# Altium schematic sheet Main.SchDoc: Main
size A4; Date: 05.10.2017; CheckedBy: UNCHECKED; Author: Lukas Deeken; Organization: Baltic Racing; Address1: Zur Schwedenschanze 15; Address2: Haus 18; Address3: 18435 Stralsund; Revision: 0.9; SheetNumber: 01; SheetTotal: 01; Rules: TODO; ProjectName: Projekt
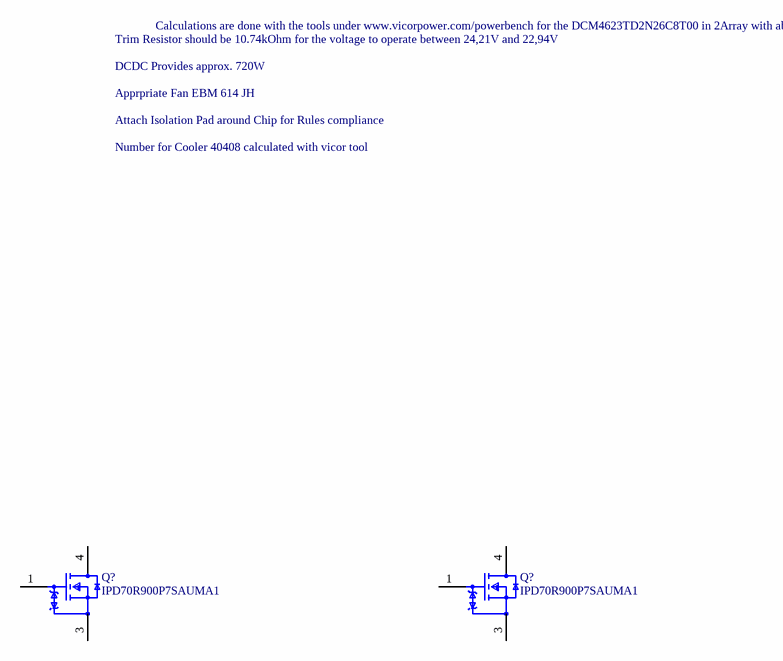
[diagram p0: Main.SchDoc]

## Parts
(Parts that share a designator on the sheet are numbered #1, #2 ... from top to bottom, then left to right.)
Q?#1  IPD70R900P7SAUMA1  [FP-PG-TO252-3-MFG]
Q?#2  IPD70R900P7SAUMA1  [FP-PG-TO252-3-MFG]

## Nets

Not connected (* = marked no-connect by the designer): Q?#1 1(Gate) 3(Source) 4(Drain); Q?#2 1(Gate) 3(Source) 4(Drain)

## Notes on the sheet
- Trim Resistor should be 10.74kOhm for the voltage to operate between 24,21V and 22,94V
- Calculations are done with the tools under www.vicorpower.com/powerbench for the DCM4623TD2N26C8T00 in 2Array with about 30A output at 24V out and between 131V to 280V
- DCDC Provides approx. 720W
- Apprpriate Fan EBM 614 JH
- Attach Isolation Pad around Chip for Rules compliance
- Number for Cooler 40408 calculated with vicor tool
- Title:
- Projekt:
- Revision:
- Author:
- Rules:
- Checked by:
- Sheet
- of
- Size:
- A4
- Date:
- Time:

## Library data of the parts
Q?#1 Q?#2 = CMP-32901-000138-1: MOSFET N-CH 700V 6A TO252-3; Manufacturer: Infineon; Gate To Source Voltage: 16V; Turn Off Delay Time: 58ns; Standoff Height: 0mm; Number Of Channels: 1; Input Capacitace At Vds: 211pF @ 400V; Depletion Mode: False; Threshold Vgs Min: 2.5V; Max Junction Temp: +150°C; Turn On Delay Time: 12ns; Threshold Vgs Max: 3.5V; Pulse Drain Current: 12.8A; Rthja Max: 62°C/W; Power Dissipation: 30.5W; Typ Forward Diode Voltage: 0.9V; Gate Charge At Vgs: 6.8nC @ 10V; Reverse Recovery Charge: 500nC; Reverse Recovery Time: 160ns; Drain To Source Resistance: 0.74Ω; Octopart: https://octopart.com/ipd70r900p7sauma1-infineon-77042867; Height: 2.55mm; ComponentLink2URL: https://www.infineon.com/dgdl/Infineon-IPD70R900P7S-DataSheet-v02_02-EN.pdf?fileId=5546d462584d1d4a0158cf8102e90d98; Temperature Range High: +150°C; Temperature: -40°C to +150°C; Footprint Url: https://www.infineon.com/cms/en/product/packages/PG-TO252/PG-TO252-3-344/; ComponentLink2Description: Datasheet; Drain To Source Voltage: 700V; Manufacturer Part Number: IPD70R900P7SAUMA1; Digikey Description: MOSFET N-CH 700V 6A TO252-3; Continuous Drain Current: 6A; Device Class L2: Transistors; Number Of N Channels: 1; Category: Trans; Lead Free: Yes; Temperature Range Low: -40°C; Automotive: No; RoHS: TRUE; Device Class L1: Discrete Semiconductors; Drain To Source Breakdown Voltage: 700V; Package: PG-TO252-3; Device Class L3: MOSFETs